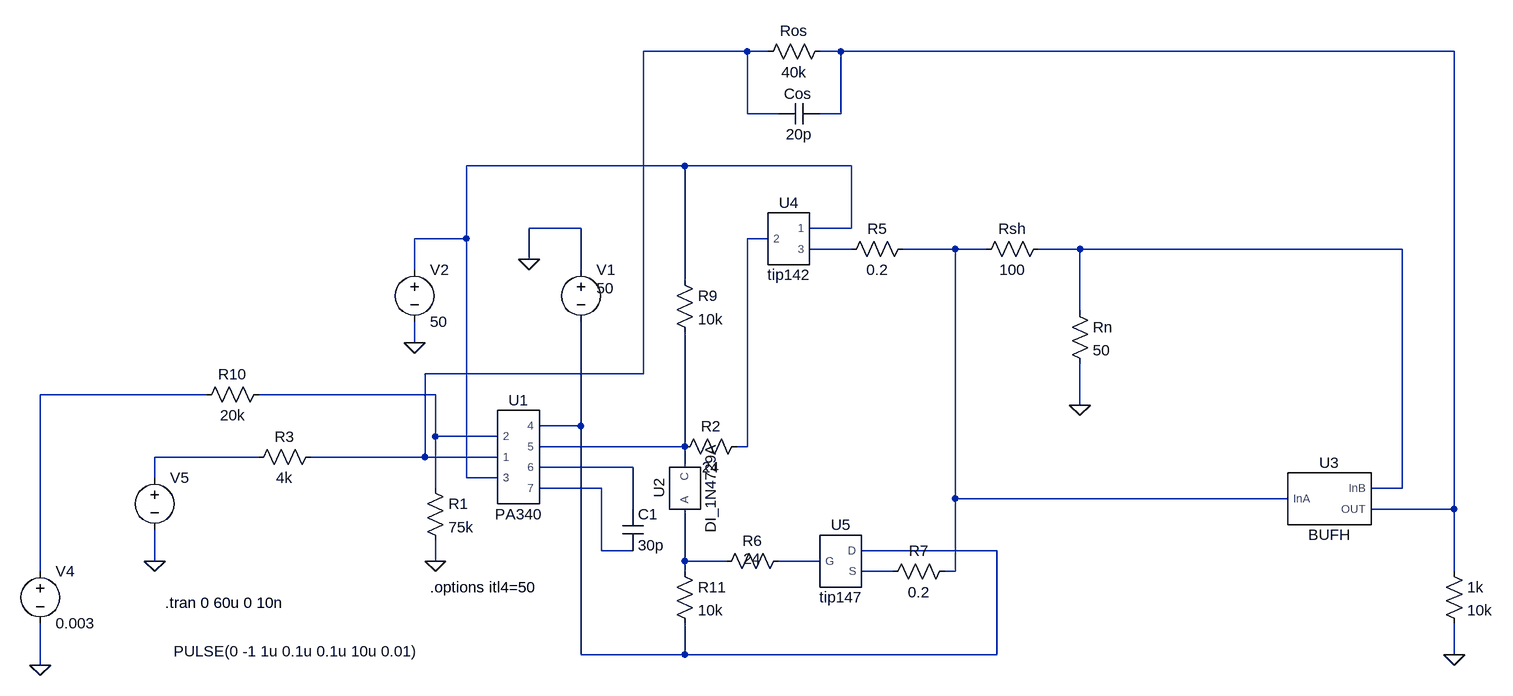
[diagram p0: schematic Draft17.asc]
Draft17.asc, the LTspice schematic file:
Version 4
SHEET 1 1700 680
WIRE 544 -464 384 -464
WIRE 576 -464 544 -464
WIRE 688 -464 656 -464
WIRE 1632 -464 688 -464
WIRE 544 -368 544 -464
WIRE 592 -368 544 -368
WIRE 688 -368 688 -464
WIRE 688 -368 656 -368
WIRE 448 -288 112 -288
WIRE 704 -288 448 -288
WIRE 288 -192 208 -192
WIRE 704 -192 704 -288
WIRE 704 -192 640 -192
WIRE 112 -176 112 -288
WIRE 112 -176 32 -176
WIRE 576 -176 544 -176
WIRE 704 -160 640 -160
WIRE 864 -160 784 -160
WIRE 912 -160 864 -160
WIRE 1056 -160 992 -160
WIRE 1552 -160 1056 -160
WIRE 208 -144 208 -192
WIRE 32 -128 32 -176
WIRE 288 -128 288 -192
WIRE 448 -112 448 -288
WIRE 1056 -64 1056 -160
WIRE 32 -16 32 -48
WIRE 384 32 384 -464
WIRE 384 32 48 32
WIRE -288 64 -544 64
WIRE 64 64 -208 64
WIRE 1056 80 1056 16
WIRE 288 112 288 -48
WIRE 288 112 224 112
WIRE 64 128 64 64
WIRE 160 128 64 128
WIRE 448 144 448 -32
WIRE 448 144 224 144
WIRE 544 144 544 -176
WIRE 544 144 528 144
WIRE -208 160 -368 160
WIRE 48 160 48 32
WIRE 48 160 -128 160
WIRE 160 160 48 160
WIRE 368 176 224 176
WIRE 448 176 448 144
WIRE -368 192 -368 160
WIRE 112 192 112 -176
WIRE 160 192 112 192
WIRE 64 208 64 128
WIRE 320 208 224 208
WIRE 1552 208 1552 -160
WIRE 1552 208 1504 208
WIRE 864 224 864 -160
WIRE 1376 224 864 224
WIRE 368 240 368 176
WIRE 1632 240 1632 -464
WIRE 1632 240 1504 240
WIRE 320 304 320 208
WIRE 368 304 320 304
WIRE 928 304 720 304
WIRE -368 320 -368 272
WIRE 64 320 64 288
WIRE 448 320 448 240
WIRE 512 320 448 320
WIRE 656 320 592 320
WIRE -544 336 -544 64
WIRE 448 336 448 320
WIRE 768 336 720 336
WIRE 864 336 864 224
WIRE 864 336 848 336
WIRE 1632 336 1632 240
WIRE 288 464 288 112
WIRE 448 464 448 416
WIRE 448 464 288 464
WIRE 928 464 928 304
WIRE 928 464 448 464
WIRE 1632 464 1632 416
WIRE -544 480 -544 416
FLAG 32 -16 0
FLAG 208 -144 0
FLAG -544 480 0
FLAG 1056 80 0
FLAG -368 320 0
FLAG 64 320 0
FLAG 1632 464 0
SYMBOL PA340 192 160 R0
SYMATTR InstName U1
SYMBOL res 48 192 R0
SYMATTR InstName R1
SYMATTR Value 75k
SYMBOL res 544 128 R90
WINDOW 0 0 56 VBottom 2
WINDOW 3 32 56 VTop 2
SYMATTR InstName R2
SYMATTR Value 24
SYMBOL res -112 144 R90
WINDOW 0 0 56 VBottom 2
WINDOW 3 32 56 VTop 2
SYMATTR InstName R3
SYMATTR Value 4k
SYMBOL cap 352 240 R0
SYMATTR InstName C1
SYMATTR Value 30p
SYMBOL voltage 288 -144 R0
WINDOW 3 24 44 Left 2
WINDOW 123 0 0 Left 0
WINDOW 39 0 0 Left 0
SYMATTR Value 50
SYMATTR InstName V1
SYMBOL voltage 32 -144 R0
WINDOW 123 0 0 Left 0
WINDOW 39 0 0 Left 0
SYMATTR InstName V2
SYMATTR Value 50
SYMBOL res 1040 -80 R0
SYMATTR InstName Rn
SYMATTR Value 50
SYMBOL res 672 -480 R90
WINDOW 0 0 56 VBottom 2
WINDOW 3 32 56 VTop 2
SYMATTR InstName Ros
SYMATTR Value 40k
SYMBOL cap 656 -384 R90
WINDOW 0 1 34 VBottom 2
WINDOW 3 32 32 VTop 2
SYMATTR InstName Cos
SYMATTR Value 20p
SYMBOL res -192 48 R90
WINDOW 0 0 56 VBottom 2
WINDOW 3 32 56 VTop 2
SYMATTR InstName R10
SYMATTR Value 20k
SYMBOL voltage -368 176 R0
WINDOW 123 0 0 Left 0
WINDOW 39 0 0 Left 0
WINDOW 3 29 283 Left 2
SYMATTR Value PULSE(0 -1 1u 0.1u 0.1u 10u 0.01)
SYMATTR InstName V5
SYMBOL res 608 304 R90
WINDOW 0 0 56 VBottom 2
WINDOW 3 28 56 VBottom 2
SYMATTR InstName R6
SYMATTR Value 24
SYMBOL voltage -544 320 R0
WINDOW 123 0 0 Left 0
WINDOW 39 0 0 Left 0
SYMATTR InstName V4
SYMATTR Value 0.003
SYMBOL tip142 608 -176 R0
SYMATTR InstName U4
SYMBOL tip147 688 320 R0
SYMATTR InstName U5
SYMBOL res 800 -176 R90
WINDOW 0 0 56 VBottom 2
WINDOW 3 32 56 VTop 2
SYMATTR InstName R5
SYMATTR Value 0.2
SYMBOL res 864 320 R90
WINDOW 0 0 56 VBottom 2
WINDOW 3 32 56 VTop 2
SYMATTR InstName R7
SYMATTR Value 0.2
SYMBOL res 432 -128 R0
SYMATTR InstName R9
SYMATTR Value 10k
SYMBOL res 432 320 R0
SYMATTR InstName R11
SYMATTR Value 10k
SYMBOL DI_1N4729A 448 208 R270
SYMATTR InstName U2
SYMBOL res 1008 -176 R90
WINDOW 0 0 56 VBottom 2
WINDOW 3 32 56 VTop 2
SYMATTR InstName Rsh
SYMATTR Value 100
SYMBOL res 1616 320 R0
SYMATTR InstName 1k
SYMATTR Value 10k
SYMBOL bufh 1440 224 R0
SYMATTR InstName U3
TEXT -352 384 Left 2 !.tran 0 60u 0 10n
TEXT 56 360 Left 2 !.options itl4=50

The netlist it stands for:
* Draft17.asc
XU1 N009 N001 N003 N010 N011 N013 N014 PA340  ; pins 2 1 3 4 5 6 7
R1 N009 0 75k
R2 N004 N011 24
R3 N001 N012 4k
C1 N013 N014 30p
V1 0 N010 50
V2 N003 0 50
Rn N007 0 50
Ros N002 N001 40k
Cos N002 N001 20p
R10 N009 N008 20k
V5 N012 0 PULSE(0 -1 1u 0.1u 0.1u 10u 0.01)
R6 N016 N015 24
V4 N008 0 0.003
XU4 N003 N004 N005 tip142  ; pins 1 2 3
XU5 N010 N016 N017 tip147  ; pins D G S
R5 N006 N005 0.2
R7 N006 N017 0.2
R9 N003 N011 10k
R11 N015 N010 10k
XU2 N015 N011 DI_1N4729A  ; pins A C
Rsh N007 N006 100
R§1k N002 0 10k
XU3 N006 N007 N002 BUFH  ; pins InA InB OUT
.tran 0 60u 0 10n
.options itl4=50
.lib PA340_Pspice.LIB
.lib TIP142.cir
.lib TIP147.cir
.lib DI_1N4729A.cir
.lib BufH.cir
.backanno
.end